# EAGLE schematic ramp-v1 (EAGLE 5.10)
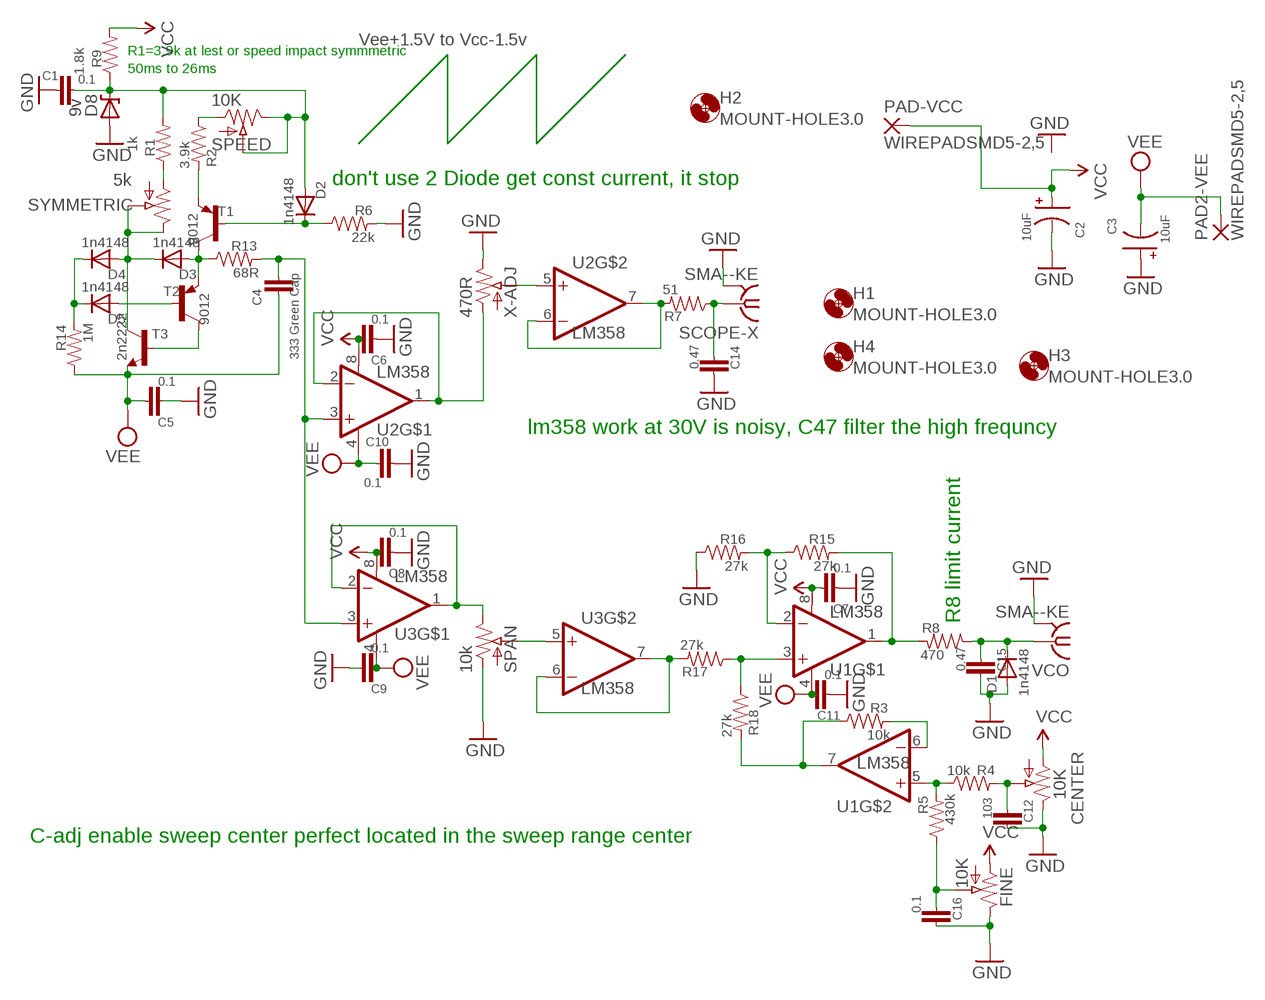
[diagram p0: schematic, sheet 1]

## Parts
C1  0.1  CAP-C0805  [C0805]
C2  10uF  CAP_POL1206  [EIA3216]
C3  10uF  CAP_POL1206  [EIA3216]
C4  333 Green Cap  CAPPTH1  [CAP-PTH-5MM]
C5  0.1  CAP-C0805  [C0805]
C6  0.1  CAP-C0805  [C0805]
C7  0.1  CAP-C0805  [C0805]
C8  0.1  CAP-C0805  [C0805]
C9  0.1  CAP-C0805  [C0805]
C10  0.1  CAP-C0805  [C0805]
C11  0.1  CAP-C0805  [C0805]
C12  103  CAP-C0805  [C0805]
C14  0.47  CAP-C0805  [C0805]
C15  0.47  CAP-C0805  [C0805]
C16  0.1  CAP-C0805  [C0805]
CENTER  10K  POTPANNEL  [POT-PANNEL]
D1  1n4148  DIODE1206  [1206-DIODE]
D2  1n4148  DIODE1206  [1206-DIODE]
D3  1n4148  DIODE1206  [1206-DIODE]
D4  1n4148  DIODE1206  [1206-DIODE]
D5  1n4148  DIODE1206  [1206-DIODE]
D8  9v  DIODE-ZENERPTH  [DIODE-ZENER]
FINE  10K  POTPANNEL  [POT-PANNEL]
H1  MOUNT-HOLE3.0  [3,0]
H2  MOUNT-HOLE3.0  [3,0]
H3  MOUNT-HOLE3.0  [3,0]
H4  MOUNT-HOLE3.0  [3,0]
PAD2-VEE  WIREPADSMD5-2,5  [5-2,5]
PAD-VCC  WIREPADSMD5-2,5  [5-2,5]
R1  1k  RESISTOR-R0805W  [R0805W]
R2  3.9k  RESISTOR-R0805W  [R0805W]
R3  10k  RESISTOR-R0805W  [R0805W]
R4  10k  RESISTOR-R0805W  [R0805W]
R5  430k  RESISTOR-R0805W  [R0805W]
R6  22k  RESISTOR-R0805W  [R0805W]
R7  51  RESISTOR-R0805W  [R0805W]
R8  470  RESISTOR-R0805W  [R0805W]
R9  1.8k  RESISTOR-R0805W  [R0805W]
R13  68R  RESISTOR0805  [0805]
R14  1M  RESISTOR-R0805W  [R0805W]
R15  27k  RESISTOR-R0805W  [R0805W]
R16  27k  RESISTOR-R0805W  [R0805W]
R17  27k  RESISTOR-R0805W  [R0805W]
R18  27k  RESISTOR-R0805W  [R0805W]
SCOPE-X  SMA--KE  [SMA-KE]
SPAN  10k  POTPANNEL  [POT-PANNEL]
SPEED  10K  POTPANNEL  [POT-PANNEL]
SYMMETRIC  5k  POTB25P-3362P  [B25P]
T1  9012  90**-PNP-TO92-EBC  [TO92-EBC]
T2  9012  90**-PNP-TO92-EBC  [TO92-EBC]
T3  2n2222  -NPN-TO92-EBC  [TO92-EBC]
U1  LM358  LM358-SO08  [SO08]
U2  LM358  LM358-SO08  [SO08]
U3  LM358  LM358-SO08  [SO08]
VCO  SMA--KE  [SMA-KE]
X-ADJ  470R  POTB25P-3362P  [B25P]

## Nets
GND: C1.1 C2.C(-) C3.A(+) C5.2 C6.2 C7.2 C8.2 C9.1 C10.1 C11.2 C12.1 C14.1 C15.1 C16.1 CENTER.E D1.A D8.P$2(A) FINE.E R6.2 R16.1 SCOPE-X.G@1(GND) SPAN.A VCO.G@1(GND) X-ADJ.E
N$1: C1.2 D2.A D8.P$1(C) R1.2 R9.1 SPEED.E SPEED.S
N$3: SPAN.E U3.1(OUT) U3.2(-IN)
N$4: R4.1 R5.2 U1.5(+IN)
N$5: D3.A R13.1 T1.C T2.E
N$6: D5.A T2.B
N$7: T2.C T3.B
N$8: D4.K(C) D5.K(C) R14.2
N$9: D3.K(C) D4.A SYMMETRIC.E SYMMETRIC.S T3.C
N$10: R2.2 T1.E
N$11: R17.1 R18.1 U1.3(+IN)
N$12: R2.1 SPEED.A
N$13: D2.K(C) R6.1 T1.B
N$14: C4.1 R13.2 U2.3(+IN) U3.3(+IN)
N$15: R1.1 SYMMETRIC.A
N$16: SPAN.S U3.5(+IN)
N$17: U2.1(OUT) U2.2(-IN) X-ADJ.A
N$18: U2.5(+IN) X-ADJ.S
N$19: R17.2 U3.6(-IN) U3.7(OUT)
N$21: C12.2 CENTER.S R4.2
N$22: C16.2 FINE.S R5.1
N$23: R15.1 R16.2 U1.2(-IN)
N$24: R7.2 U2.6(-IN) U2.7(OUT)
N$25: C14.2 R7.1 SCOPE-X.1
N$26: R8.2 R15.2 U1.1(OUT)
N$27: C15.2 D1.K(C) R8.1 VCO.1
N$28: R3.1 R18.2 U1.7(OUT)
N$29: R3.2 U1.6(-IN)
VCC: C2.A(+) C6.1 C7.1 C8.1 CENTER.A FINE.A PAD-VCC.1(P) R9.2 U1.8(V+) U2.8(V+) U3.8(V+)
VEE: C3.C(-) C4.2 C5.1 C9.2 C10.2 C11.1 PAD2-VEE.1(P) R14.1 T3.E U1.4(V-) U2.4(V-) U3.4(V-)

## Notes on the sheet
- R1=3.9k at lest or speed impact symmmetric | Vee+1.5V to Vcc-1.5v
- 50ms to 26ms
- don't use 2 Diode get const current, it stop
- lm358 work at 30V is noisy, C47 filter the high frequncy
- R8 limit current
- C-adj enable sweep center perfect located in the sweep range center

## Power pins joined to a net without a drawn wire
GND: SCOPE-X.G@2(GND) SCOPE-X.G@3(GND) SCOPE-X.G@4(GND) VCO.G@2(GND) VCO.G@3(GND) VCO.G@4(GND)

## Library data of the parts
C1 C4-C12 C14-C16 = digital-toy:CAP: Capacitor Standard 0603 ceramic capacitor, and 0.1" leaded capacitor.
C2 C3 = digital-toy:CAP_POL: Capacitor Polarized These are standard SMD and PTH capacitors. Normally 10uF, 47uF, and 100uF in electrolytic and tantalum varieties. Always verify the external diameter of the through hole cap, it varies with capacity, voltage, and manufacturer. The EIA devices should be standard. PANASONIC_D size: 6.5mmx6.5mmx5.5mm, 100uf (taobao:6.3mmx5.5mm), same as CVL0605 153cvl0405 size: 4mmx4mmx5.5mm, 10uf (taobao:4mmx5.5mm) ct6032 typical 47uF Tantalum, comment by hyl.
CENTER FINE SPAN SPEED SYMMETRIC X-ADJ = digital-toy:POT: POT digital toy POT, 3296 multi turn, blue-white ... hyl 8/07/2001
D1-D5 = digital-toy:DIODE: Diode These are standard reverse protection diodes and small signal diodes. SMA package can handle up to about 1A. SOD-323 can handle about 200mA. What the SOD-323 package when ordering, there are some mfgs out there that are 5-pin packages.
D8 = digital-toy:DIODE-ZENER: Zener Diode Production Part - 8199 3.4V Zener Voltage
H1-H4 = holes:MOUNT-HOLE: MOUNTING HOLE with drill center marker
PAD2-VEE PAD-VCC = wirepad:WIREPAD: Wire PAD connect wire on PCB
R1-R9 R13-R18 = digital-toy:RESISTOR: Resistor Basic schematic elements and footprints for 0603, 1206, and PTH 1/10th watt (small) resistors. digital-toy copy vertical mount of axial-0.3 from rcl.lbr : the 0207/xx 3W resistor: 0617/17, 0617/22, 0617V
SCOPE-X VCO = dtoy-RF:SMA-: SMA 50 Ohm End Launch Jack Receptacle - Round Contact Johnson Components Source: www.johnsoncomponents.com .. J502-ND.pdf
T1 T2 = digital-toy:*-PNP-: PNP Transistror
T3 = digital-toy:*-NPN-: NPN Transistror most of sot-23 use the pacages sot23-BEC, top C, left B, right E. by hyl, digital-toy. and to-92 use ebc(from-top) by hyl, digital-toy.
U1-U3 = digital-toy:LM358